# Altium schematic sheet EC_Circuit.SchDoc
size A
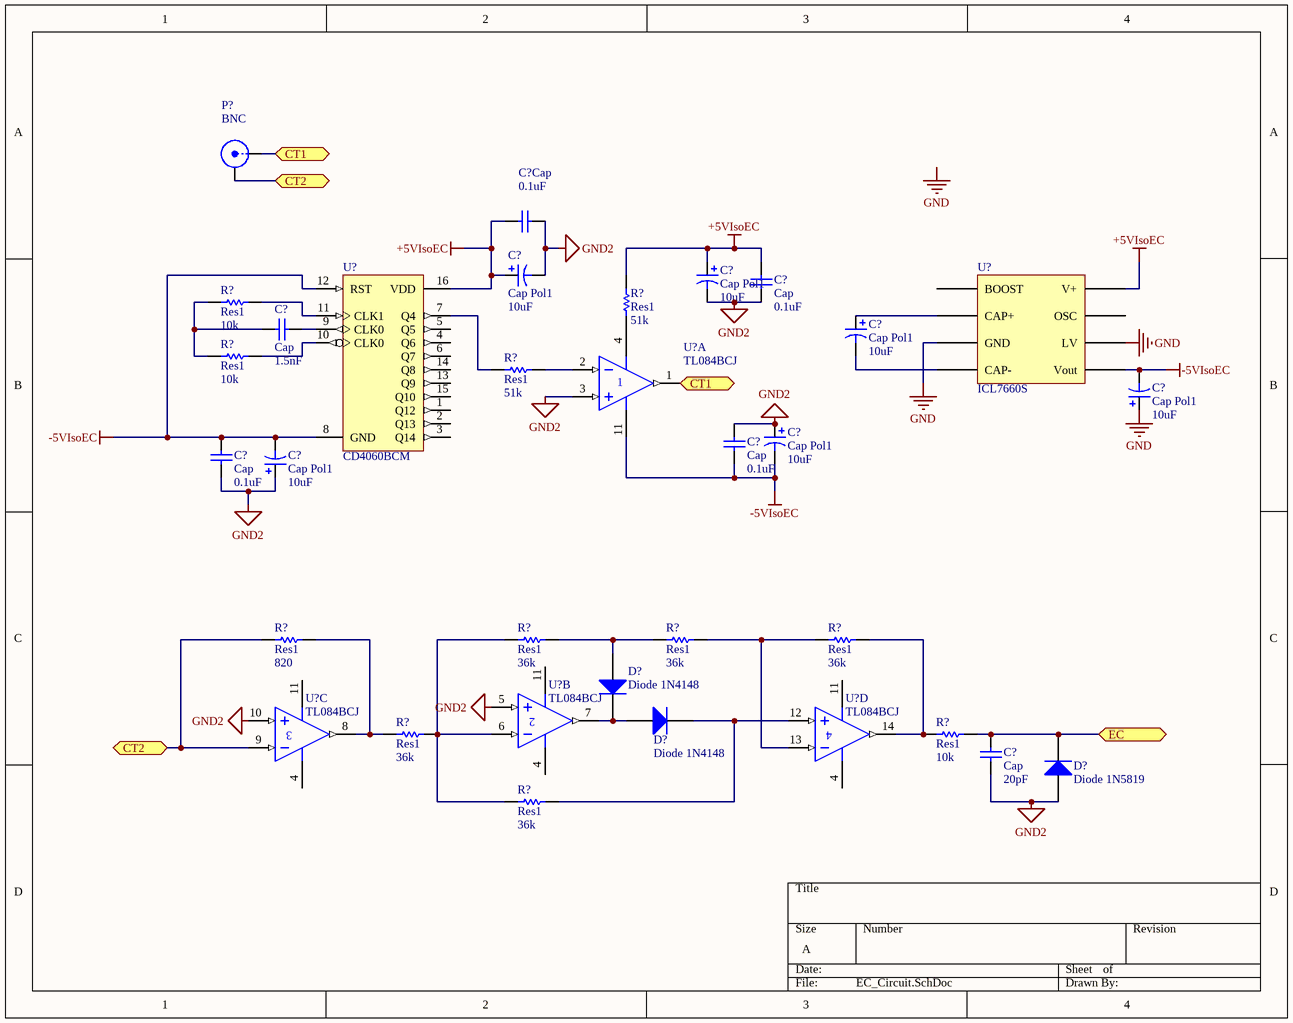
[diagram p0: EC_Circuit.SchDoc]

## Parts
(Parts that share a designator on the sheet are numbered #1, #2 ... from top to bottom, then left to right.)
C?#1  Cap  value 0.1uF  [RESC2012L]
C?#2  Cap Pol1  value 10uF  [CAPC3216L]
C?#3  Cap Pol1  value 10uF  [CAPC3216L]
C?#4  Cap  value 0.1uF  [RESC2012L]
C?#5  Cap  value 1.5nF  [RESC2012L]
C?#6  Cap Pol1  value 10uF  [CAPC3216L]
C?#7  Cap Pol1  value 10uF  [CAPC3216L]
C?#8  Cap  value 0.1uF  [RESC2012L]
C?#9  Cap Pol1  value 10uF  [CAPC3216L]
C?#10  Cap  value 0.1uF  [RESC2012L]
C?#11  Cap Pol1  value 10uF  [CAPC3216L]
C?#12  Cap  value 20pF  [RESC2012L]
D?#1  Diode 1N4148  [SOD123/X.85]
D?#2  Diode 1N4148  [SOD123/X.85]
D?#3  Diode 1N5819  [SOD123/X.85]
P?  BNC  [BNC_RA CON]
R?#1  Res1  value 10k  [RESC2012L]
R?#2  Res1  value 51k  [RESC2012L]
R?#3  Res1  value 10k  [RESC2012L]
R?#4  Res1  value 51k  [RESC2012L]
R?#5  Res1  value 820  [RESC2012L]
R?#6  Res1  value 36k  [RESC2012L]
R?#7  Res1  value 36k  [RESC2012L]
R?#8  Res1  value 36k  [RESC2012L]
R?#9  Res1  value 36k  [RESC2012L]
R?#10  Res1  value 10k  [RESC2012L]
R?#11  Res1  value 36k  [RESC2012L]
U?#1  CD4060BCM  [M16A_N]
U?#2  ICL7660S  [SOIC127P600-8M]
U?#3  TL084BCJ  [NSO14_M]  (part A of 4)
U?#4  TL084BCJ  [NSO14_M]  (part B of 4)
U?#5  TL084BCJ  [NSO14_M]  (part C of 4)
U?#6  TL084BCJ  [NSO14_M]  (part D of 4)

## Ports
CT1, CT2, EC

## Nets
+5VIsoEC: C?#1.1 C?#2.1 C?#3.1 C?#4.1 R?#2.2 U?#1.16(VDD) U?#2.8(V+)
-5VIsoEC: C?#7.2 C?#8.2 C?#9.2 C?#10.2 C?#11.2 U?#1.8(GND) U?#1.12(RST) U?#2.5(Vout) U?#3.11(V-)
GND: C?#7.1 U?#2.3(GND) U?#2.6(LV)
GND2: C?#1.2 C?#2.2 C?#3.2 C?#4.2 C?#8.1 C?#9.1 C?#10.1 C?#11.1 C?#12.2 D?#3.1(A) U?#3.3(IN+) U?#4.5(IN+) U?#5.10(IN+)
CT1: P?.1(X) U?#3.1(OUT) ; port CT1
CT2: P?.2(Y) R?#5.1 U?#5.9(IN-) ; port CT2
EC: C?#12.1 D?#3.2(K) R?#10.2 ; port EC
NetC?#5_1: C?#5.1 R?#1.1 R?#3.1
NetC?#5_2: C?#5.2 U?#1.9(CLK0)
NetC?#6_1: C?#6.1 U?#2.2(CAP+)
NetC?#6_2: C?#6.2 U?#2.4(CAP-)
NetD?#1_1: D?#1.1(A) R?#6.2 R?#7.1
NetD?#1_2: D?#1.2(K) D?#2.1(A) U?#4.7(OUT)
NetD?#2_2: D?#2.2(K) R?#11.2 U?#6.12(IN+)
NetR?#1_2: R?#1.2 U?#1.11(CLK1)
NetR?#2_1: R?#2.1 U?#3.4(V+)
NetR?#3_2: R?#3.2 U?#1.10(CLK0)
NetR?#4_1: R?#4.1 U?#1.7(Q4)
NetR?#4_2: R?#4.2 U?#3.2(IN-)
NetR?#5_2: R?#5.2 R?#9.1 U?#5.8(OUT)
NetR?#6_1: R?#6.1 R?#9.2 R?#11.1 U?#4.6(IN-)
NetR?#7_2: R?#7.2 R?#8.1 U?#6.13(IN-)
NetR?#8_2: R?#8.2 R?#10.1 U?#6.14(OUT)

Not connected (* = marked no-connect by the designer): U?#1 1(Q12) 2(Q13) 3(Q14) 4(Q6) 5(Q5) 6(Q7) 13(Q9) 14(Q8) 15(Q10); U?#2 1(BOOST) 7(OSC); U?#4 4(V+) 11(V-); U?#5 4(V+) 11(V-); U?#6 4(V+) 11(V-)

## Notes on the sheet
- Labels drawn without touching a wire or pin: GND

## Library data of the parts
C?#1 C?#4 C?#5 C?#8 C?#10 C?#12 = Cap: Capacitor; Published: 8-Jun-2000; LatestRevisionDate: 17-Jul-2002; LatestRevisionNote: Re-released for DXP Platform.; PackageReference: RAD-0.3; Publisher: Altium Limited
C?#2 C?#3 C?#6 C?#7 C?#9 C?#11 = Cap Pol1: Polarized Capacitor (Radial); Published: 8-Jun-2000; LatestRevisionDate: 17-Jul-2002; LatestRevisionNote: Re-released for DXP Platform.; PackageReference: RB7.6-15; Publisher: Altium Limited
D?#1 D?#2 = Diode 1N4148: High Conductance Fast Diode; Published: 8-Jun-2000; LatestRevisionDate: 17-Jul-2002; LatestRevisionNote: Re-released for DXP Platform.; DatasheetVersion: 1997; PackageReference: DO-35; Publisher: Altium Limited; Code_JEDEC: DO-204-AH; ComponentLink1Description: Manufacturer Link; ComponentLink1URL: http://www.fairchildsemi.com/; ComponentLink2Description: Datasheet; ComponentLink2URL: http://www.fairchildsemi.com/ds/1N%2F1N4148.pdf
D?#3 = Diode 1N4001: 1 Amp General Purpose Rectifier; Published: 8-Jun-2000; LatestRevisionDate: 17-Jul-2002; LatestRevisionNote: Re-released for DXP Platform.; DatasheetVersion: 1998; PackageVersion: Aug-1999; PackageReference: DO-41; Publisher: Altium Limited; Code_JEDEC: DO-204-AL; ComponentLink1Description: Manufacturer Link; ComponentLink1URL: http://www.fairchildsemi.com/; ComponentLink2Description: Datasheet; ComponentLink2URL: http://www.fairchildsemi.com/ds/1N%2F1N4001.pdf
P? = BNC: BNC Elbow Connector; LatestRevisionDate: 17-Jul-2002; LatestRevisionNote: Re-released for DXP Platform.; Publisher: Altium Limited
R?#1-R?#11 = Res1: Resistor; Published: 8-Jun-2000; LatestRevisionDate: 17-Jul-2002; LatestRevisionNote: Re-released for DXP Platform.; PackageReference: AXIAL-0.3; Publisher: Altium Limited
U?#1 = CD4060BCM: 14-Stage Ripple Carry Binary Counter; Published: 17-Jul-2002; LatestRevisionDate: 13-Apr-2006; LatestRevisionNote: IPC-7351 Footprint Added.; DatasheetVersion: Jan-1999; PackageVersion: 2000; PackageReference: M16A; Publisher: Altium Limited; PackageDescription: 16-Pin Small Outline Integrated Circuit 1.27 mm Pitch; Code_IPC: SOIC127P600-16; ComponentLink1Description: Manufacturer Link; ComponentLink1URL: http://www.fairchildsemi.com/; ComponentLink2Description: Datasheet; ComponentLink2URL: http://www.fairchildsemi.com/ds/CD%2FCD4040BC.pdf
U?#3-U?#6 = TL084BCJ: JFET-Input Operational Amplifier; Published: 17-Jul-2002; LatestRevisionDate: 06-Jun-2005; LatestRevisionNote: Stylized 3D Model Added.; DatasheetVersion: 1988; PackageReference: 632-08; Publisher: Altium Limited; PackageDescription: DIP; 14 Leads; Row Spacing 7.62 mm; Pitch 2.54 mm; ComponentLink1Description: Manufacturer Link; ComponentLink1URL: http://www.onsemi.com/site/products/parametrics/0,4446,251,00.html